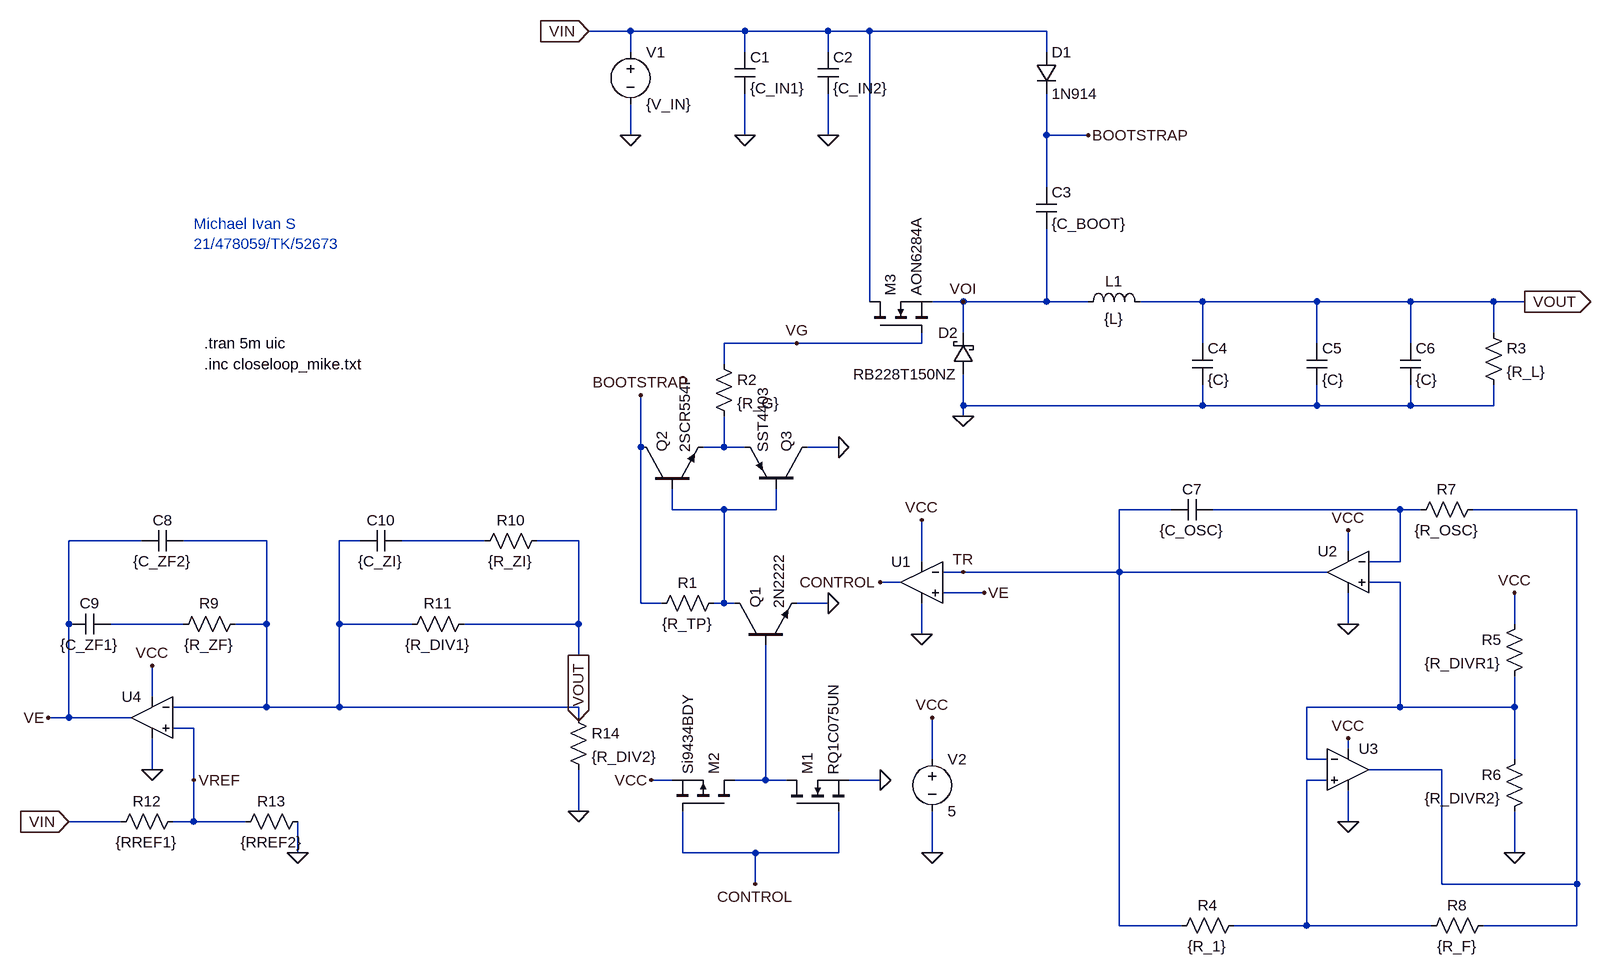
[diagram p0: schematic clooseloop_mike.asc]
clooseloop_mike.asc, the LTspice schematic file:
Version 4
SHEET 1 2348 1224
WIRE 848 -272 784 -272
WIRE 1024 -272 848 -272
WIRE 1152 -272 1024 -272
WIRE 1216 -272 1152 -272
WIRE 1488 -272 1216 -272
WIRE 848 -240 848 -272
WIRE 1024 -240 1024 -272
WIRE 1152 -240 1152 -272
WIRE 1488 -240 1488 -272
WIRE 848 -112 848 -160
WIRE 1024 -112 1024 -176
WIRE 1152 -112 1152 -176
WIRE 1488 -112 1488 -176
WIRE 1552 -112 1488 -112
WIRE 1488 -32 1488 -112
WIRE 1216 144 1216 -272
WIRE 1360 144 1312 144
WIRE 1488 144 1488 32
WIRE 1488 144 1360 144
WIRE 1552 144 1488 144
WIRE 1728 144 1632 144
WIRE 1904 144 1728 144
WIRE 2048 144 1904 144
WIRE 2176 144 2048 144
WIRE 2224 144 2176 144
WIRE 1360 192 1360 144
WIRE 2176 192 2176 144
WIRE 1104 208 992 208
WIRE 1296 208 1296 192
WIRE 1296 208 1104 208
WIRE 1728 208 1728 144
WIRE 1904 208 1904 144
WIRE 2048 208 2048 144
WIRE 992 240 992 208
WIRE 1360 304 1360 256
WIRE 1728 304 1728 272
WIRE 1728 304 1360 304
WIRE 1904 304 1904 272
WIRE 1904 304 1728 304
WIRE 2048 304 2048 272
WIRE 2048 304 1904 304
WIRE 2176 304 2176 272
WIRE 2176 304 2048 304
WIRE 1360 320 1360 304
WIRE 864 368 864 288
WIRE 992 368 992 320
WIRE 992 368 960 368
WIRE 1024 368 992 368
WIRE 1168 368 1120 368
WIRE 912 464 912 432
WIRE 992 464 912 464
WIRE 1072 464 1072 432
WIRE 1072 464 992 464
WIRE 1680 464 1600 464
WIRE 2032 464 1744 464
WIRE 2064 464 2032 464
WIRE 2304 464 2144 464
WIRE 96 512 -16 512
WIRE 288 512 160 512
WIRE 432 512 400 512
WIRE 624 512 496 512
WIRE 768 512 704 512
WIRE 1952 528 1952 496
WIRE 1296 544 1296 480
WIRE 2032 544 2032 464
WIRE 2032 544 1984 544
WIRE 1360 560 1328 560
WIRE 1600 560 1600 464
WIRE 1600 560 1360 560
WIRE 1920 560 1600 560
WIRE 1264 576 1232 576
WIRE 2032 576 1984 576
WIRE 1392 592 1328 592
WIRE 864 608 864 368
WIRE 896 608 864 608
WIRE 992 608 992 464
WIRE 992 608 976 608
WIRE 1008 608 992 608
WIRE 1152 608 1104 608
WIRE -16 640 -16 512
WIRE 160 640 48 640
WIRE 288 640 288 512
WIRE 288 640 240 640
WIRE 400 640 400 512
WIRE 512 640 400 640
WIRE 768 640 768 512
WIRE 768 640 592 640
WIRE 1952 640 1952 592
WIRE 2208 640 2208 592
WIRE 1296 656 1296 608
WIRE 768 688 768 640
WIRE 112 752 112 704
WIRE 288 768 288 640
WIRE 288 768 144 768
WIRE 400 768 400 640
WIRE 400 768 288 768
WIRE 768 768 400 768
WIRE 2032 768 2032 576
WIRE 2032 768 1888 768
WIRE 2208 768 2208 720
WIRE 2208 768 2032 768
WIRE -16 784 -16 640
WIRE -16 784 -48 784
WIRE 80 784 -16 784
WIRE 768 784 768 768
WIRE 176 800 144 800
WIRE 1952 832 1952 816
WIRE 1312 848 1312 784
WIRE 1888 848 1888 768
WIRE 1920 848 1888 848
WIRE 2208 848 2208 768
WIRE 112 864 112 816
WIRE 2096 864 1984 864
WIRE 176 880 176 800
WIRE 912 880 880 880
WIRE 1056 880 1056 672
WIRE 1056 880 1008 880
WIRE 1088 880 1056 880
WIRE 1232 880 1184 880
WIRE 1920 880 1888 880
WIRE 768 928 768 864
WIRE 64 944 -16 944
WIRE 176 944 176 880
WIRE 176 944 144 944
WIRE 256 944 176 944
WIRE 1952 944 1952 896
WIRE 336 992 336 944
WIRE 928 992 928 928
WIRE 1040 992 928 992
WIRE 1168 992 1168 928
WIRE 1168 992 1040 992
WIRE 1312 992 1312 928
WIRE 2208 992 2208 928
WIRE 1040 1040 1040 992
WIRE 2096 1040 2096 864
WIRE 2304 1040 2304 464
WIRE 2304 1040 2096 1040
WIRE 1600 1104 1600 560
WIRE 1696 1104 1600 1104
WIRE 1888 1104 1888 880
WIRE 1888 1104 1776 1104
WIRE 2080 1104 1888 1104
WIRE 2304 1104 2304 1040
WIRE 2304 1104 2160 1104
FLAG 848 -112 0
FLAG 1024 -112 0
FLAG 1152 -112 0
FLAG 1232 880 0
FLAG 1152 608 0
FLAG 1168 368 0
FLAG 1360 320 0
FLAG 1312 992 0
FLAG 1952 640 0
FLAG 1952 944 0
FLAG 2208 992 0
FLAG 1296 656 0
FLAG 768 928 0
FLAG 336 992 0
FLAG 112 864 0
FLAG 1040 1040 CONTROL
FLAG 880 880 VCC
FLAG 1296 480 VCC
FLAG 864 288 BOOTSTRAP
FLAG 1552 -112 BOOTSTRAP
FLAG 1360 144 VOI
FLAG 1104 208 VG
FLAG 784 -272 VIN
IOPIN 784 -272 In
FLAG 2224 144 VOUT
IOPIN 2224 144 Out
FLAG 1312 784 VCC
FLAG 112 704 VCC
FLAG -16 944 VIN
IOPIN -16 944 In
FLAG -48 784 VE
FLAG 176 880 VREF
FLAG 768 688 VOUT
IOPIN 768 688 Out
FLAG 1392 592 VE
FLAG 1232 576 CONTROL
FLAG 1952 496 VCC
FLAG 1952 816 VCC
FLAG 2208 592 VCC
FLAG 1360 560 TR
SYMBOL nmos 1088 928 R270
SYMATTR InstName M1
SYMATTR Value RQ1C075UN
SYMBOL pmos 1008 928 M270
SYMATTR InstName M2
SYMATTR Value Si9434BDY
SYMBOL res 880 624 R270
WINDOW 0 32 56 VTop 2
WINDOW 3 0 56 VBottom 2
SYMATTR InstName R1
SYMATTR Value {R_TP}
SYMBOL npn 1008 672 R270
SYMATTR InstName Q1
SYMATTR Value 2N2222
SYMBOL npn 864 432 R270
SYMATTR InstName Q2
SYMATTR Value 2SCR554P
SYMBOL pnp 1120 432 M270
SYMATTR InstName Q3
SYMATTR Value SST4403
SYMBOL res 976 224 R0
SYMATTR InstName R2
SYMATTR Value {R_G}
SYMBOL nmos 1216 192 R270
SYMATTR InstName M3
SYMATTR Value AON6284A
SYMBOL voltage 848 -256 R0
SYMATTR InstName V1
SYMATTR Value {V_IN}
SYMBOL cap 1008 -240 R0
SYMATTR InstName C1
SYMATTR Value {C_IN1}
SYMBOL cap 1136 -240 R0
SYMATTR InstName C2
SYMATTR Value {C_IN2}
SYMBOL diode 1472 -240 R0
SYMATTR InstName D1
SYMATTR Value 1N914
SYMBOL cap 1472 -32 R0
SYMATTR InstName C3
SYMATTR Value {C_BOOT}
SYMBOL ind 1536 160 R270
WINDOW 0 32 56 VTop 2
WINDOW 3 5 56 VBottom 2
SYMATTR InstName L1
SYMATTR Value {L}
SYMBOL cap 1712 208 R0
SYMATTR InstName C4
SYMATTR Value {C}
SYMBOL cap 1888 208 R0
SYMATTR InstName C5
SYMATTR Value {C}
SYMBOL cap 2032 208 R0
SYMATTR InstName C6
SYMATTR Value {C}
SYMBOL res 2160 176 R0
SYMATTR InstName R3
SYMATTR Value {R_L}
SYMBOL schottky 1376 256 R180
WINDOW 0 24 64 Left 2
WINDOW 3 24 0 Left 2
SYMATTR InstName D2
SYMATTR Value RB228T150NZ
SYMBOL OpAmps\\UniversalOpAmp2 1296 576 M0
SYMATTR InstName U1
SYMBOL OpAmps\\UniversalOpAmp2 1952 560 M0
SYMATTR InstName U2
SYMBOL OpAmps\\UniversalOpAmp2 1952 864 R0
SYMATTR InstName U3
SYMBOL cap 1680 480 R270
WINDOW 0 32 32 VTop 2
WINDOW 3 0 32 VBottom 2
SYMATTR InstName C7
SYMATTR Value {C_OSC}
SYMBOL res 1680 1120 R270
WINDOW 0 32 56 VTop 2
WINDOW 3 0 56 VBottom 2
SYMATTR InstName R4
SYMATTR Value {R_1}
SYMBOL res 2224 624 M0
SYMATTR InstName R5
SYMATTR Value {R_DIVR1}
SYMBOL res 2224 832 M0
SYMATTR InstName R6
SYMATTR Value {R_DIVR2}
SYMBOL res 2048 480 R270
WINDOW 0 32 56 VTop 2
WINDOW 3 0 56 VBottom 2
SYMATTR InstName R7
SYMATTR Value {R_OSC}
SYMBOL res 2064 1120 R270
WINDOW 0 32 56 VTop 2
WINDOW 3 0 56 VBottom 2
SYMATTR InstName R8
SYMATTR Value {R_F}
SYMBOL voltage 1312 832 R0
SYMATTR InstName V2
SYMATTR Value 5
SYMBOL cap 96 528 R270
WINDOW 0 32 32 VTop 2
WINDOW 3 0 32 VBottom 2
SYMATTR InstName C8
SYMATTR Value {C_ZF2}
SYMBOL cap -16 656 R270
WINDOW 0 32 32 VTop 2
WINDOW 3 0 32 VBottom 2
SYMATTR InstName C9
SYMATTR Value {C_ZF1}
SYMBOL res 144 656 R270
WINDOW 0 32 56 VTop 2
WINDOW 3 0 56 VBottom 2
SYMATTR InstName R9
SYMATTR Value {R_ZF}
SYMBOL cap 432 528 R270
WINDOW 0 32 32 VTop 2
WINDOW 3 0 32 VBottom 2
SYMATTR InstName C10
SYMATTR Value {C_ZI}
SYMBOL res 608 528 R270
WINDOW 0 32 56 VTop 2
WINDOW 3 0 56 VBottom 2
SYMATTR InstName R10
SYMATTR Value {R_ZI}
SYMBOL res 496 656 R270
WINDOW 0 32 56 VTop 2
WINDOW 3 0 56 VBottom 2
SYMATTR InstName R11
SYMATTR Value {R_DIV1}
SYMBOL res 48 960 R270
WINDOW 0 32 56 VTop 2
WINDOW 3 0 56 VBottom 2
SYMATTR InstName R12
SYMATTR Value {RREF1}
SYMBOL res 240 960 R270
WINDOW 0 32 56 VTop 2
WINDOW 3 0 56 VBottom 2
SYMATTR InstName R13
SYMATTR Value {RREF2}
SYMBOL res 752 768 R0
SYMATTR InstName R14
SYMATTR Value {R_DIV2}
SYMBOL OpAmps\\UniversalOpAmp2 112 784 M0
SYMATTR InstName U4
TEXT 176 24 Left 2 ;Michael Ivan S\n21/478059/TK/52673
TEXT 192 240 Left 2 !.inc closeloop_mike.txt
TEXT 192 208 Left 2 !.tran 5m uic

The netlist it stands for:
* clooseloop_mike.asc
M1 N009 CONTROL 0 0 RQ1C075UN
M2 N009 CONTROL VCC VCC Si9434BDY
R1 BOOTSTRAP N002 {R_TP}
Q1 N002 N009 0 0 2N2222
Q2 BOOTSTRAP N002 N001 0 2SCR554P
Q3 0 N002 N001 0 SST4403
R2 VG N001 {R_G}
M3 VIN VG VOI VOI AON6284A
V1 VIN 0 {V_IN}
C1 VIN 0 {C_IN1}
C2 VIN 0 {C_IN2}
D1 VIN BOOTSTRAP 1N914
C3 BOOTSTRAP VOI {C_BOOT}
L1 VOI VOUT {L}
C4 VOUT 0 {C}
C5 VOUT 0 {C}
C6 VOUT 0 {C}
R3 VOUT 0 {R_L}
D2 0 VOI RB228T150NZ
XU1 VE TR VCC 0 CONTROL level2 Avol=1Meg GBW=10Meg Slew=10Meg Ilimit=25m Rail=0 Vos=0 En=0 Enk=0 In=0 Ink=0 Rin=500Meg  ; pins In+ In- V+ V- OUT
XU2 N007 N003 VCC 0 TR level2 Avol=1Meg GBW=10Meg Slew=10Meg Ilimit=25m Rail=0 Vos=0 En=0 Enk=0 In=0 Ink=0 Rin=500Meg  ; pins In+ In- V+ V- OUT
XU3 N010 N007 VCC 0 N004 level2 Avol=1Meg GBW=10Meg Slew=10Meg Ilimit=25m Rail=0 Vos=0 En=0 Enk=0 In=0 Ink=0 Rin=500Meg  ; pins In+ In- V+ V- OUT
C7 TR N003 {C_OSC}
R4 TR N010 {R_1}
R5 VCC N007 {R_DIVR1}
R6 N007 0 {R_DIVR2}
R7 N003 N004 {R_OSC}
R8 N010 N004 {R_F}
V2 VCC 0 5
C8 VE N005 {C_ZF2}
C9 VE N008 {C_ZF1}
R9 N008 N005 {R_ZF}
C10 N005 N006 {C_ZI}
R10 N006 VOUT {R_ZI}
R11 N005 VOUT {R_DIV1}
R12 VIN VREF {RREF1}
R13 VREF 0 {RREF2}
R14 N005 0 {R_DIV2}
XU4 VREF N005 VCC 0 VE level2 Avol=1Meg GBW=10Meg Slew=10Meg Ilimit=25m Rail=0 Vos=0 En=0 Enk=0 In=0 Ink=0 Rin=500Meg  ; pins In+ In- V+ V- OUT
.model D D
.lib standard.dio
.model NPN NPN
.model PNP PNP
.lib standard.bjt
.model NMOS NMOS
.model PMOS PMOS
.lib standard.mos
* Michael Ivan S
* 21/478059/TK/52673
.inc closeloop_mike.txt
.tran 5m uic
.lib UniversalOpAmp2.lib
.backanno
.end